# Altium schematic sheet 1_P1.schdoc.schdoc
size 309 x 223 mm; Symbol: Sheet-Symbol_A4; Device: Sheet-Symbol_A4; Company: 嘉立创EDA; Drawed: Cameorn Bright; Reviewed: Cameorn Bright; Version: V1.0; Page Size: A4; @Project Name: Smoke-purifier-Mini; @Page Count: 1; @Update Date: 2024-06-20; @Create Date: 2024-04-06; @Schematic Name: Smoke purifier Mini; @Page No: 1; @Page Name: P1
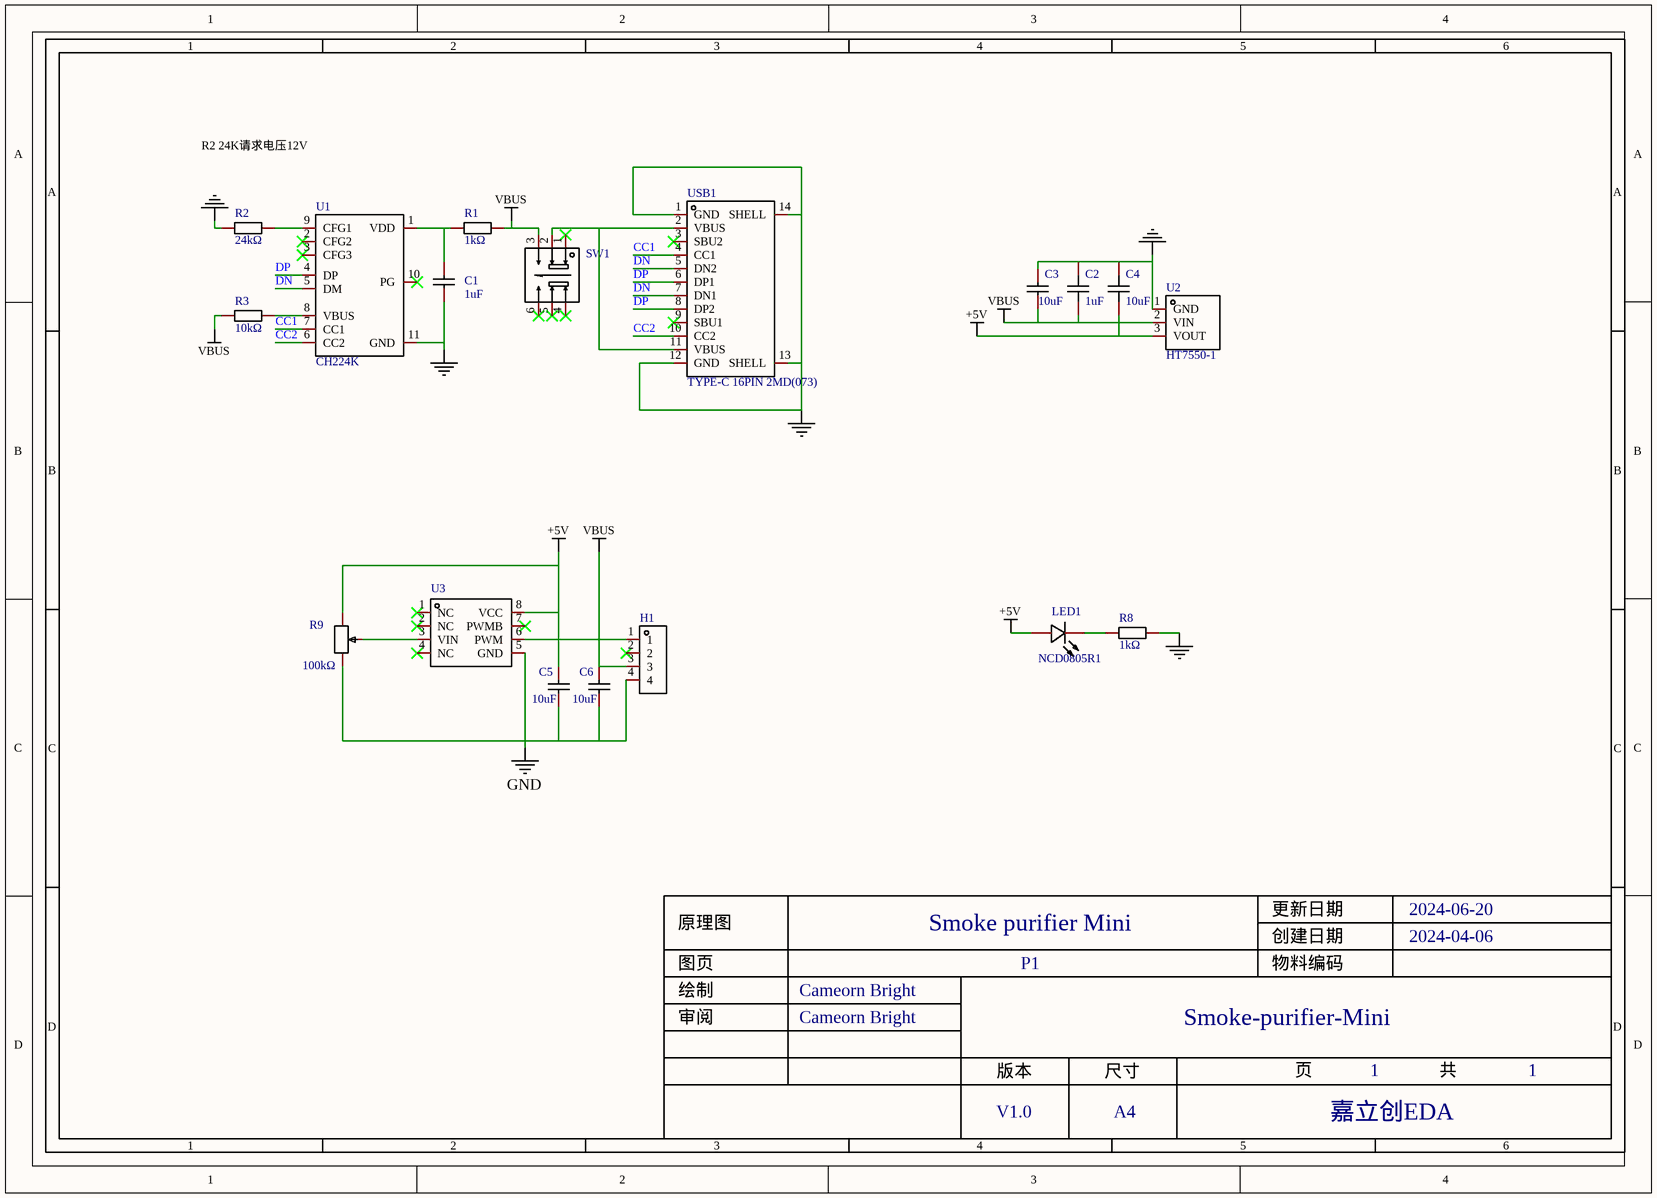
[diagram p0: 1_P1.schdoc.schdoc]

## Parts
C1  1uF  [C0603]
C2  1uF  [C0805]
C3  10uF  [C0805]
C4  10uF  [C0805]
C5  value 10uF  [C0603]  (hidden comment: GRM188R6YA106MA73D)
C6  value 10uF  [C0603]  (hidden comment: GRM188R6YA106MA73D)
H1  HDR-F_2.54_1x4P  [HDR-TH_4P-P2.54-V-F]  (value not drawn)
LED1  NCD0805R1  [LED0805-R-RD]
R1  1kΩ  [R0603]
R2  24kΩ  [R0603]
R3  10kΩ  [R0603]
R8  1kΩ  [R0603]
R9  100kΩ  [RES-ADJ-TH_R12-B503-3P]
SW1  PS-5850A-6PL  [SW-TH_6P-L5.8-W5.8-P2.00-LS4.5-BL_1]  (value not drawn)
U1  CH224K  [ESSOP-10_L4.9-W3.9-P1.0-LS6.0-TL-EP]
U2  HT7550-1  [SOT-89_L4.5-W2.5-P1.50-LS4.2-BR]
U3  GP9101-F20K-L2H1-SW  [SOP-8_L5.0-W3.9-P1.27-LS6.0-BL]  (value not drawn)
USB1  TYPE-C 16PIN 2MD(073)  [USB-C-SMD_TYPE-C-6PIN-2MD-073]

## Nets
+5V: C4.1 C5.2 LED1.1(+) R9.3 U2.3(VOUT) U3.8(VCC)
GND: C1.1 C2.2 C3.2 C4.2 C5.1 C6.1 H1.4 R2.2 R8.2 R9.1 U1.11(GND) U2.1(GND) U3.5(GND) USB1.1(GND) USB1.12(GND) USB1.13(SHELL) USB1.14(SHELL)
VBUS: C2.1 C3.1 C6.2 H1.3 R1.2 R3.1 SW1.3 U2.2(VIN)
CC1: U1.7(CC1) USB1.4(CC1)
CC2: U1.6(CC2) USB1.10(CC2)
DN: U1.5(DM) USB1.5(DN2) USB1.7(DN1)
DP: U1.4(DP) USB1.6(DP1) USB1.8(DP2)
NetC1_2: C1.2 R1.1 U1.1(VDD)
NetH1_1: H1.1 U3.6(PWM)
NetLED1_2: LED1.2(-) R8.1
NetR2_1: R2.1 U1.9(CFG1)
NetR3_2: R3.2 U1.8(VBUS)
NetR9_2: R9.2 U3.3(VIN)
NetSW1_2: SW1.2 USB1.2(VBUS) USB1.11(VBUS)

Not connected (* = marked no-connect by the designer): H1 2*; SW1 1* 4* 5* 6*; U1 2(CFG2)* 3(CFG3)* 10(PG)*; U3 1(NC)* 2(NC)* 4(NC)* 7(PWMB)*; USB1 3(SBU2)* 9(SBU1)*

## Notes on the sheet
- R2 24K请求电压12V
- 1
- 2
- 3
- 4
- 5
- 6
- A
- B
- C
- 原理图
- Smoke purifier Mini
- 创建日期
- 更新日期
- 2024-06-20
- 2024-04-06
- 审阅
- 绘制
- 图页
- Cameorn Bright
- P1
- 物料编码
- Smoke-purifier-Mini
- D
- 版本
- 尺寸
- 页
- 共
- V1.0
- A4
- 嘉立创EDA

## Library data of the parts
C1 = CL10A105KB8NNNC: Manufacturer: SAMSUNG(三星); Add into BOM: yes; Tolerance: ±10%; Voltage Rated: 50V; Temperature Coefficient: X5R; Description: 容值:1uF;精度:±10%;额定电压:50V;材质(温度系数):X5R;; Name: 1uF; Symbol: CL10A105KB8NNNC; Device: CL10A105KB8NNNC; Supplier: LCSC; Manufacturer Part: CL10A105KB8NNNC; Value: 1uF; Supplier Part: C15849; JLCPCB Part Class: 基础库; LCSC Part Name: 1uF ±10% 50V; Supplier Footprint: 0603; Datasheet: https://atta.szlcsc.com/upload/public/pdf/source/20160218/1457707763339.pdf; Convert to PCB: yes
C2 C4 = GRM21BR61H106KE43L: Manufacturer: muRata(村田); Add into BOM: yes; Tolerance: ±10%; Voltage Rated: 50V; Temperature Coefficient: X5R; Description: 容值:10uF;精度:±10%;额定电压:50V;材质(温度系数):X5R;; Symbol: GRM21BR61H106KE43L; Device: GRM21BR61H106KE43L; Supplier: LCSC; Supplier Part: C440198; Manufacturer Part: GRM21BR61H106KE43L; JLCPCB Part Class: 基础库; LCSC Part Name: 10uF ±10% 50V; Supplier Footprint: 0805; Datasheet: https://atta.szlcsc.com/upload/public/pdf/source/20230811/95AAE0C9AF55EDC31B7A4D8B733F534E.pdf; Convert to PCB: yes
  C2: Name: 1uF; Value: 1uF
  C4: Name: 10uF; Value: 10uF
C3 = CL21B105KBFNNNE: Manufacturer: SAMSUNG(三星); Add into BOM: yes; Tolerance: ±10%; Voltage Rated: 50V; Temperature Coefficient: X7R; Description: 容值:1uF;精度:±10%;额定电压:50V;材质(温度系数):X7R;; Name: 10uF; Symbol: CL21B105KBFNNNE; Device: CL21B105KBFNNNE; Supplier: LCSC; Manufacturer Part: CL21B105KBFNNNE; Value: 10uF; Supplier Part: C28323; JLCPCB Part Class: 基础库; LCSC Part Name: 1uF ±10% 50V; Supplier Footprint: 0805; Datasheet: https://atta.szlcsc.com/upload/public/pdf/source/20160218/1457707763339.pdf; Convert to PCB: yes
C5 C6 = GRM188R6YA106MA73D: Manufacturer: muRata(村田); Symbol: cl10a106mo8nqnc; Add into BOM: yes; Tolerance: ±20%; Voltage Rated: 35V; Description: 容值:10uF;精度:±20%;额定电压:35V;材质(温度系数):-;; Device: GRM188R6YA106MA73D; LCSC Part Name: 10uF ±20% 35V; Supplier Part: C194427; Manufacturer Part: GRM188R6YA106MA73D; Supplier Footprint: 0603; JLCPCB Part Class: Extended Part; Datasheet: https://atta.szlcsc.com/upload/public/pdf/source/20210128/C194427_FCA3640823207DDB58700A82F1A19B5F.pdf; Supplier: LCSC; Convert to PCB: yes; Temperature Coefficient: -
H1 = HDR-F_2.54_1x4P: Manufacturer: BOOMELE(博穆精密); Symbol: 2.54-1*4P母; Convert to PCB: yes; Device: HDR-F_2.54_1x4P; Supplier: LCSC; Supplier Part: C2718488; Manufacturer Part: 2.54-1*4P母; JLCPCB Part Class: Extended Part; Add into BOM: yes; Supplier Footprint: 插件
LED1 = NCD0805R1: Manufacturer: 国星光电; Symbol: FC-2012HRK-620D; Add into BOM: yes; Emitted Color: 红色; Forward Voltage (VF): 1.6V~2.6V; Power Dissipation: 65mW; Forward Current: 20mA; Dominant Wavelength: 615nm~630nm; Diode Configuration: 独立二极管; Lens Color: 无色透明透镜; Luminous Intensity: 67mcd~195mcd; Viewing Angle: 130°; Description: 灯头类型:-;发光颜色:红色;正向电压(VF):1.6V~2.6V;功率:65mW;正向电流:20mA;主波长:615nm~630nm;二极管配置:独立二极管;透镜颜色:无色透明透镜;色温:-;发光强度:67mcd~195mcd;发光角度:130°;载带方式:-;工作温度:-30℃~+85℃;; Name: NCD0805R1; Device: NCD0805R1; Supplier: LCSC; Manufacturer Part: NCD0805R1; Supplier Part: C84256; JLCPCB Part Class: 基础库; LCSC Part Name: NCD0805R1; Supplier Footprint: 0805; Datasheet: https://atta.szlcsc.com/upload/public/pdf/source/20200820/C84256_F0A75A43B3EAD75808600A0514C76B99.pdf; Convert to PCB: yes; Lamp Holder Type: -; Peak Wavelength: -; Color Temperature: -; Mounting Sytle: -; Operating Temperature: -30℃~+85℃
R1 R8 = RC0603FR-071KL: Manufacturer: YAGEO(国巨); Add into BOM: yes; Tolerance: ±1%; Power(Watts): 100mW; Overload Voltage (Max): 75V; Temperature Coefficient: ±100ppm/℃; Description: 电阻类型:厚膜电阻;阻值:1kΩ;精度:±1%;功率:100mW;最大工作电压:75V;温度系数:±100ppm/℃;; Name: 1kΩ; Symbol: RC0603FR-071KL; Device: RC0603FR-071KL; LCSC Part Name: 厚膜电阻 1kΩ ±1% 100mW; Supplier Part: C22548; Manufacturer Part: RC0603FR-071KL; Supplier Footprint: 0603; JLCPCB Part Class: 扩展库; Datasheet: https://atta.szlcsc.com/upload/public/pdf/source/20180316/70C0E2BDAE7FCC62C531A5A58D202EE1.pdf; Supplier: LCSC; Convert to PCB: yes; Type: 厚膜电阻; Value: 1kΩ; Operating Temperature Range: -55℃~+155℃
R2 = 0603WAF2402T5E: Manufacturer: UNI-ROYAL(厚声); Add into BOM: yes; Tolerance: ±1%; Power(Watts): 100mW; Overload Voltage (Max): 75V; Temperature Coefficient: ±100ppm/℃; Description: 电阻类型:厚膜电阻;阻值:24kΩ;精度:±1%;功率:100mW;最大工作电压:75V;温度系数:±100ppm/℃;; Name: 24kΩ; Symbol: 0603WAF2402T5E; Device: 0603WAF2402T5E; Supplier: LCSC; Manufacturer Part: 0603WAF2402T5E; Supplier Part: C23352; Value: 24kΩ; JLCPCB Part Class: 基础库; LCSC Part Name: 24kΩ ±1% 100mW 厚膜电阻; Supplier Footprint: 0603; Datasheet: https://atta.szlcsc.com/upload/public/pdf/source/20200306/C422600_1E6D84923E4A46A82E41ADD87F860B5C.pdf; Convert to PCB: yes; Type: 厚膜电阻; Operating Temperature Range: -55℃~+155℃
R3 = 0603WAF1002T5E: Manufacturer: UNI-ROYAL(厚声); Add into BOM: yes; Tolerance: ±1%; Power(Watts): 100mW; Overload Voltage (Max): 75V; Temperature Coefficient: ±100ppm/℃; Description: 电阻类型:厚膜电阻;阻值:10kΩ;精度:±1%;功率:100mW;最大工作电压:75V;温度系数:±100ppm/℃;; Name: 10kΩ; Symbol: 0603WAF1002T5E; Device: 0603WAF1002T5E; Supplier: LCSC; Manufacturer Part: 0603WAF1002T5E; Supplier Part: C25804; Value: 10kΩ; JLCPCB Part Class: 基础库; LCSC Part Name: 厚膜电阻 10kΩ ±1% 100mW; Supplier Footprint: 0603; Datasheet: https://atta.szlcsc.com/upload/public/pdf/source/20200306/C422600_1E6D84923E4A46A82E41ADD87F860B5C.pdf; Convert to PCB: yes; Type: 厚膜电阻; Operating Temperature Range: -55℃~+155℃
R9 = 3296W-1-104LF: Manufacturer: BOURNS; Add into BOM: yes; Tolerance: ±10%; Power(Watts): 500mW; Temperature Coefficient: ±100ppm/℃; Turns: 25; Description: 阻值:100kΩ;精度:±10%;功率:500mW;温度系数:±100ppm/℃;; Name: 100kΩ; Symbol: 3296W-1-104LF; Device: 3296W-1-104LF; LCSC Part Name: 100kΩ ±10%; Supplier Part: C48084; Manufacturer Part: 3296W-1-104LF; Supplier Footprint: 插件; JLCPCB Part Class: 扩展库; Datasheet: https://atta.szlcsc.com/upload/public/pdf/source/20151026/1457707506403.pdf; Supplier: LCSC; Convert to PCB: yes; Value: 100kΩ
SW1 = PS-5850A-6PL: Manufacturer: G-Switch(品赞); Add into BOM: yes; Circuit: 双刀双掷; Self Lock / No Lock: 自锁; Actuator Style: 矩形柱塞; Contact Current: 500mA; Voltage Rating (DC): 30V; Insulation Resistance: 100MΩ; Actuator/Cap Color: 黑色; Pin Style: PC引脚; Mechanical Life: 10万次; Description: 电路结构:双刀双掷;自锁/无锁:自锁;安装方式:直插;触点电流:500mA;额定电压 (AC):-;额定电压 (DC):30V;带灯:-;作用力:-;机械寿命:10万次;; Name: PS-5850A-6PL; Symbol: PS-5850A-6PL; Device: PS-5850A-6PL; LCSC Part Name: 自锁按键开关; Supplier Part: C963201; Manufacturer Part: PS-5850A-6PL; Supplier Footprint: 插件; JLCPCB Part Class: 扩展库; Datasheet: https://atta.szlcsc.com/upload/public/pdf/source/20201201/C963201_9229C247AC907A82E381B4EE0BC1DEDE.pdf; Supplier: LCSC; Convert to PCB: yes; IP Rating: -; Mounting Style: 直插; Voltage Rating (AC): -; With Lamp: -; Operating Force: -; Operating Temperature: -25℃~+65℃
U1 = CH224K: Manufacturer: WCH(南京沁恒); Add into BOM: yes; Applications Function: USB充电芯片; Description: 应用功能:USB充电芯片;; Name: CH224K; Symbol: CH224K; Device: CH224K; LCSC Part Name: USB PD等多快充协议受电芯片CH224; Supplier Part: C970725; Manufacturer Part: CH224K; Supplier Footprint: ESSOP-10-150mil-1mm; JLCPCB Part Class: 扩展库; Datasheet: https://atta.szlcsc.com/upload/public/pdf/source/20240313/43C2AFDDBDD1F65B60386D2CCAB0811B.pdf; Supplier: LCSC; Convert to PCB: yes
U2 = HT7550-1_C347189: Manufacturer: UMW(友台半导体); Add into BOM: yes; Output Type: 固定; Maximum Input Voltage: 30V; Output Voltage: 5V; MAX Output Current: 100mA; Dropout Voltage: 100mV@(1mA); standby current: 3uA; Output Polarity: 正极; Number of Outputs: 1; Description: 输出类型:固定;最大输入电压:30V;输出电压:5V;最大输出电流:100mA;电源纹波抑制比(PSRR):-;输出极性:正极;; Name: HT7550-1; Symbol: HT7550-1_C347189; Device: HT7550-1_C347189; LCSC Part Name: 输入30V 输出5V 100mA; Supplier Part: C347189; Manufacturer Part: HT7550-1; Supplier Footprint: SOT-89; JLCPCB Part Class: 扩展库; Datasheet: https://atta.szlcsc.com/upload/public/pdf/source/20231109/E587E38465720CDF1B9E4B203F8DC229.pdf; Supplier: LCSC; Convert to PCB: yes; Power Supply Rejection Ratio (PSRR): -; Operating Temperature: -25℃~+70℃
U3 = GP9101-F20K-L2H1-SW: Manufacturer: Guestgood(客益); Add into BOM: yes; Description: GP9101 0-VCC转PWM 20KHz L2H1; Symbol: GP9101-F20K-L2H1-SW; Device: GP9101-F20K-L2H1-SW; LCSC Part Name: 模拟信号转PWM信号; Supplier Part: C2837710; Manufacturer Part: GP9101-F20K-L2H1-SW; Supplier Footprint: SOP8; JLCPCB Part Class: 扩展库; Datasheet: https://atta.szlcsc.com/upload/public/pdf/source/20210611/C2837710_B55E2012AD9BA99B0BFF632E52DE3359.pdf; Supplier: LCSC; Convert to PCB: yes
USB1 = TYPE-C 16PIN 2MD(073): Manufacturer: SHOU HAN(首韩); Add into BOM: yes; Gender: 母; Number of Ports: 1; Number of Contacts: 16P; Current Rating - Power (Max): 5A; Description: 连接器类型:Type-C;标准:-;公母:母;端口数量:1;触点数量:16P;安装方式:卧贴;额定电流 - 电源:5A;工作温度范围:-25℃~+85℃;; Name: TYPE-C 16PIN 2MD(073); Symbol: TYPE-C 16PIN 2MD(073); Device: TYPE-C 16PIN 2MD(073); Supplier: LCSC; Supplier Part: C2765186; Manufacturer Part: TYPE-C 16PIN 2MD(073); JLCPCB Part Class: 扩展库; LCSC Part Name: Type-C 母 卧贴; Supplier Footprint: SMD; Datasheet: https://atta.szlcsc.com/upload/public/pdf/source/20211123/39B17C16241EAC15C5E277BDA434118E.pdf; Convert to PCB: yes; Connector Type: Type-C; Standard: -; Mounting Style: 卧贴; Operating Temperature Range: -25℃~+85℃